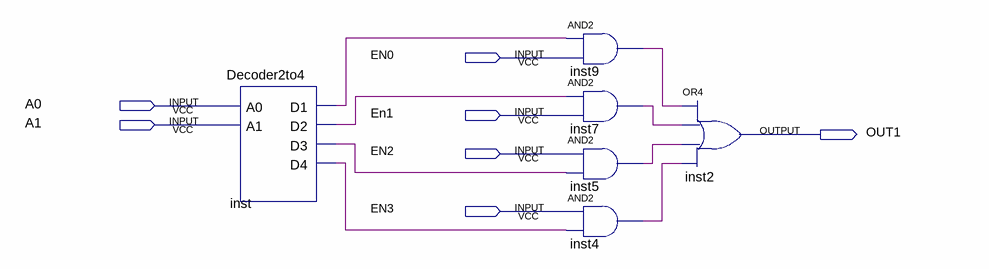
[diagram p0: schematic sheet]
// Quartus schematic MUX4-1.bdf as structural Verilog: 6 symbols, 7 pins
module \MUX4-1  (
  input  EN0,
  input  A0,
  input  En1,
  input  A1,
  input  EN2,
  input  EN3,
  output OUT1
);

  wire inst4_out, inst5_out, inst7_out, inst9_out, inst_d1, inst_d2, inst_d3, inst_d4;

  Decoder2to4 inst (.A0(A0), .A1(A1), .D1(inst_d1), .D2(inst_d2), .D3(inst_d3), .D4(inst_d4));
  and inst9 (inst9_out, inst_d1, EN0);
  and inst7 (inst7_out, inst_d2, En1);
  and inst5 (inst5_out, EN2, inst_d3);
  and inst4 (inst4_out, EN3, inst_d4);
  or inst2 (OUT1, inst9_out, inst7_out, inst5_out, inst4_out);
endmodule
